# EAGLE schematic VCA-v2a (EAGLE 7.6.0)

## Sheet 1 of 2: Power
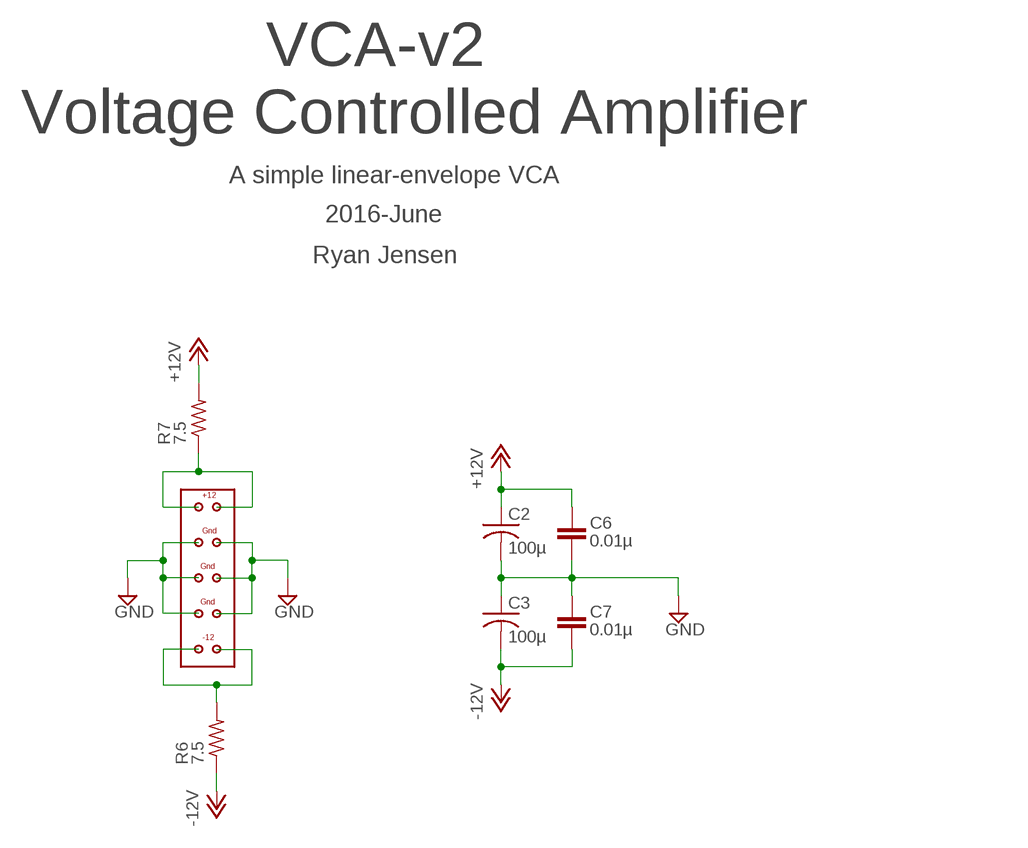
[diagram p0: schematic, sheet 1]

### Parts
C2  100µ  C-US025-050X050  [C025-050X050]
C3  100µ  C-US025-050X050  [C025-050X050]
C6  0.01µ  C-EUC0603  [C0603]
C7  0.01µ  C-EUC0603  [C0603]
R6  7.5  R-US_R0603  [R0603]
R7  7.5  R-US_R0603  [R0603]
U$1  EURORACK-POWER  [EURORACK-POWER]

### Nets
+12V: C2.1 C6.1 R7.2 ; also sheet 2
-12V: C3.2 C7.2 R6.1 ; also sheet 2
GND: C2.2 C3.1 C6.2 C7.1 U$1.P$3 U$1.P$4 U$1.P$5 U$1.P$6 U$1.P$7 U$1.P$8 ; also sheet 2
N$8: R6.2 U$1.P$9 U$1.P$10
N$10: R7.1 U$1.P$1 U$1.P$2

### Notes on the sheet
- VCA-v2
  Voltage Controlled Amplifier
- A simple linear-envelope VCA
- 2016-June
- Ryan Jensen

## Sheet 2 of 2
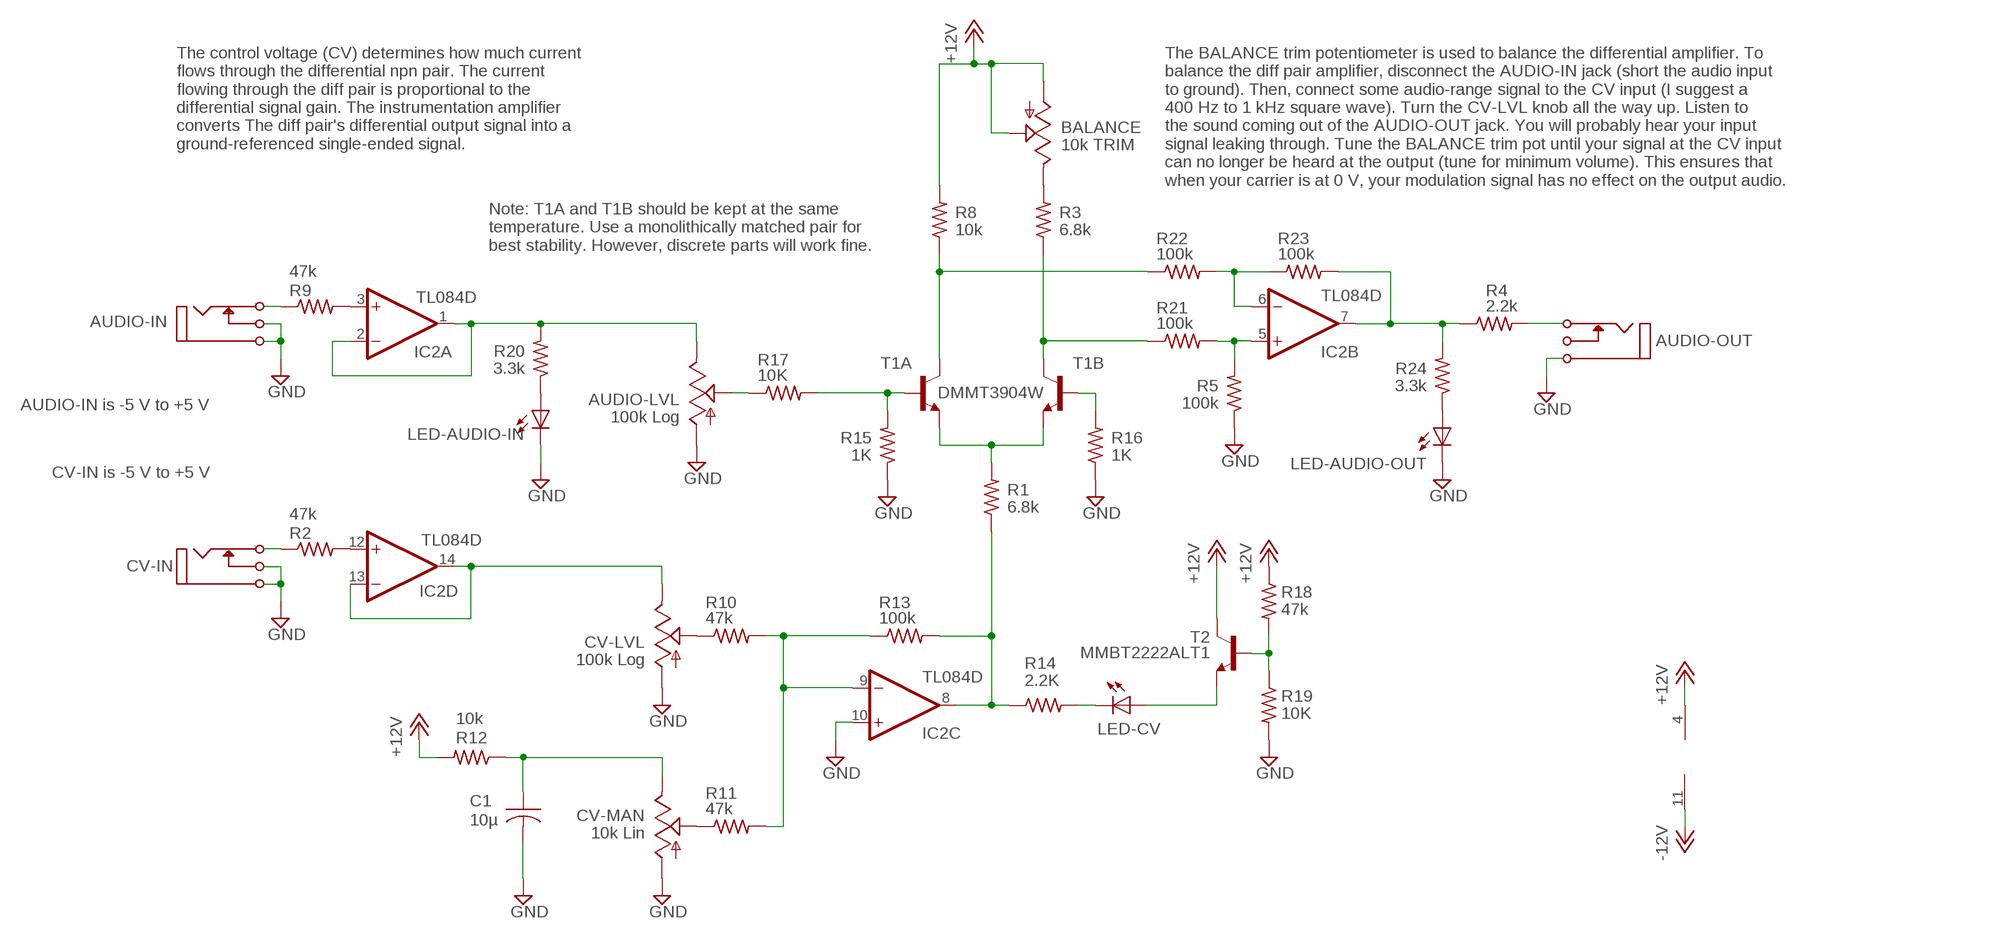
[diagram p1: schematic, sheet 2]

### Parts
AUDIO-IN  I/O  MONO_JACK  [MONO_JACK]
AUDIO-LVL  100k Log  TRIM_US-B64Y  [B64Y]
AUDIO-OUT  I/O  MONO_JACK  [MONO_JACK]
BALANCE  10k TRIM  TRIM_US-B64Y  [B64Y]
C1  10µ  C-US025-050X050  [C025-050X050]
CV-IN  I/O  MONO_JACK  [MONO_JACK]
CV-LVL  100k Log  TRIM_US-B64Y  [B64Y]
CV-MAN  10k Lin  TRIM_US-B64Y  [B64Y]
IC2  TL084D  [SO14]
LED-AUDIO-IN  TLLG4400  [LED3MM]
LED-AUDIO-OUT  TLLG4400  [LED3MM]
LED-CV  TLLG4400  [LED3MM]
R1  6.8k  R-US_R0603  [R0603]
R2  47k  R-US_R0603  [R0603]
R3  6.8k  R-US_R0603  [R0603]
R4  2.2k  R-US_R0603  [R0603]
R5  100k  R-US_R0603  [R0603]
R8  10k  R-US_R0603  [R0603]
R9  47k  R-US_R0603  [R0603]
R10  47k  R-US_R0603  [R0603]
R11  47k  R-US_R0603  [R0603]
R12  10k  R-US_R0603  [R0603]
R13  100k  R-US_R0603  [R0603]
R14  2.2K  R-US_R0603  [R0603]
R15  1K  R-US_R0603  [R0603]
R16  1K  R-US_R0603  [R0603]
R17  10K  R-US_R0603  [R0603]
R18  47k  R-US_R0603  [R0603]
R19  10K  R-US_R0603  [R0603]
R20  3.3k  R-US_R0603  [R0603]
R21  100k  R-US_R0603  [R0603]
R22  100k  R-US_R0603  [R0603]
R23  100k  R-US_R0603  [R0603]
R24  3.3k  R-US_R0603  [R0603]
T1  DMMT3904W  [SOT363]
T2  MMBT2222ALT1  MMBT2222ALT1-NPN-SOT23-BEC  [SOT23-BEC]

### Nets
+12V: BALANCE.A BALANCE.S IC2.4(P:V+) R8.2 R12.2 R18.1 T2.C ; also sheet 1
-12V: IC2.11(P:V-) ; also sheet 1
GND: AUDIO-IN.P$1 AUDIO-IN.P$3(P3) AUDIO-LVL.A AUDIO-OUT.P$1 C1.2 CV-IN.P$1 CV-IN.P$3(P3) CV-LVL.A CV-MAN.A IC2.10(C:+IN) LED-AUDIO-IN.K(C) LED-AUDIO-OUT.K(C) R5.1 R15.1 R16.1 R19.2 ; also sheet 1
LED_SUPPLY: LED-CV.A T2.E
N$1: IC2.8(C:OUT) R1.1 R13.2 R14.1
N$2: BALANCE.E R3.2
N$3: IC2.12(D:+IN) R2.2
N$4: CV-LVL.E IC2.13(D:-IN) IC2.14(D:OUT)
N$5: CV-IN.P$2(P2) R2.1
N$6: AUDIO-IN.P$2(P2) R9.1
N$7: IC2.3(A:+IN) R9.2
N$9: AUDIO-LVL.E IC2.1(A:OUT) IC2.2(A:-IN) R20.2
N$11: CV-LVL.S R10.1
N$12: LED-CV.K(C) R14.2
N$13: CV-MAN.S R11.1
N$14: C1.1 CV-MAN.E R12.1
N$15: R1.2 T1.4(B:E) T1.5(A:E)
N$16: R15.2 R17.2 T1.1(A:B)
N$17: IC2.9(C:-IN) R10.2 R11.2 R13.1
N$18: AUDIO-LVL.S R17.1
N$19: R16.2 T1.2(B:B)
N$20: R18.2 R19.1 T2.B
N$21: LED-AUDIO-IN.A R20.1
N$22: LED-AUDIO-OUT.A R24.1
N$24: R8.1 R22.1 T1.6(A:C)
N$26: R3.1 R21.1 T1.3(B:C)
N$28: IC2.5(B:+IN) R5.2 R21.2
N$30: IC2.6(B:-IN) R22.2 R23.1
N$31: IC2.7(B:OUT) R4.1 R23.2 R24.2
N$32: AUDIO-OUT.P$2(P2) R4.2
Unconnected: AUDIO-OUT.P$3(P3)

### Notes on the sheet
- The control voltage (CV) determines how much current
  flows through the differential npn pair. The current
  flowing through the diff pair is proportional to the
  differential signal gain. The instrumentation amplifier
  converts The diff pair's differential output signal into a
  ground-referenced single-ended signal.
- The BALANCE trim potentiometer is used to balance the differential amplifier. To
  balance the diff pair amplifier, disconnect the AUDIO-IN jack (short the audio input
  to ground). Then, connect some audio-range signal to the CV input (I suggest a
  400 Hz to 1 kHz square wave). Turn the CV-LVL knob all the way up. Listen to
  the sound coming out of the AUDIO-OUT jack. You will probably hear your input
  signal leaking through. Tune the BALANCE trim pot until your signal at the CV input
  can no longer be heard at the output (tune for minimum volume). This ensures that
  when your carrier is at 0 V, your modulation signal has no effect on the output audio.
- Note: T1A and T1B should be kept at the same
  temperature. Use a monolithically matched pair for
  best stability. However, discrete parts will work fine.
- AUDIO-IN is -5 V to +5 V
- CV-IN is -5 V to +5 V

## Library data of the parts
AUDIO-IN AUDIO-OUT CV-IN = !synth_sch:MONO_JACK
AUDIO-LVL BALANCE CV-LVL CV-MAN = pot:TRIM_US-: POTENTIOMETER
C1-C3 = rcl:C-US: CAPACITOR, American symbol
C6 C7 = rcl:C-EU: CAPACITOR, European symbol
IC2 = linear:TL084: OP AMP
LED-AUDIO-IN LED-AUDIO-OUT LED-CV = led:TLLG4400: Low Current (2mA) LED 3 mm Tinted Diffused Package color GREEN Source: Data sheet <http://www.farnell.com/datasheets/391098.pdf>; MF: VISHAY SEMICONDUCTOR; OC_FARNELL: 1612435
R1-R24 = resistor:R-US_: RESISTOR, American symbol
T1 = !synth_sch:DMMT3904W
T2 = transistor:*-NPN-: NPN Transistror BF959 corrected 2008.03.06
U$1 = !synth_sch:EURORACK-POWER